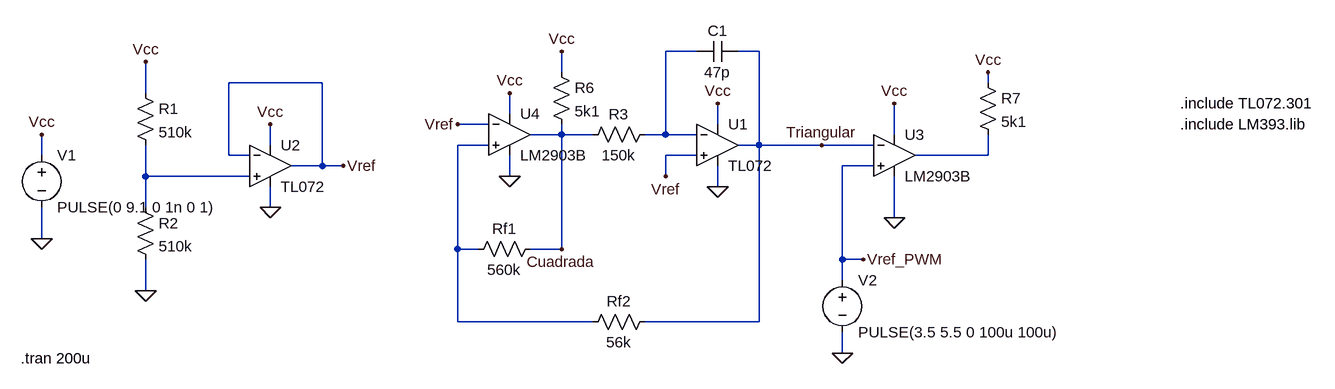
[diagram p0: schematic PWM.asc]
PWM.asc, the LTspice schematic file:
Version 4
SHEET 1 1432 680
WIRE 48 16 0 16
WIRE 144 16 112 16
WIRE -160 48 -160 16
WIRE -528 64 -672 64
WIRE 496 64 496 48
WIRE -800 80 -800 32
WIRE -240 112 -240 80
WIRE -272 128 -320 128
WIRE 80 128 80 96
WIRE -160 144 -160 128
WIRE -160 144 -208 144
WIRE -112 144 -160 144
WIRE 0 144 0 16
WIRE 0 144 -32 144
WIRE 48 144 0 144
WIRE 352 144 352 96
WIRE -608 160 -608 128
WIRE -272 160 -320 160
WIRE 144 160 144 16
WIRE 144 160 112 160
WIRE 240 160 144 160
WIRE 320 160 240 160
WIRE -960 176 -960 144
WIRE -672 176 -672 64
WIRE -640 176 -672 176
WIRE 48 176 0 176
WIRE 496 176 496 144
WIRE 496 176 384 176
WIRE -528 192 -528 64
WIRE -528 192 -576 192
WIRE -496 192 -528 192
WIRE 320 192 272 192
WIRE -800 208 -800 160
WIRE -640 208 -800 208
WIRE -240 208 -240 176
WIRE 0 208 0 176
WIRE 80 224 80 192
WIRE -800 256 -800 208
WIRE -608 256 -608 224
WIRE 352 272 352 208
WIRE -960 304 -960 256
WIRE -320 320 -320 160
WIRE -288 320 -320 320
WIRE -160 320 -160 144
WIRE -160 320 -208 320
WIRE 272 336 272 192
WIRE 304 336 272 336
WIRE 272 368 272 336
WIRE -800 384 -800 336
WIRE -320 432 -320 320
WIRE -112 432 -320 432
WIRE 144 432 144 160
WIRE 144 432 -32 432
WIRE 272 480 272 448
FLAG -960 304 0
FLAG -960 144 Vcc
FLAG -240 208 0
FLAG 80 224 0
FLAG -608 128 Vcc
FLAG -608 256 0
FLAG -800 384 0
FLAG -800 32 Vcc
FLAG -496 192 Vref
FLAG -240 80 Vcc
FLAG 80 96 Vcc
FLAG -320 128 Vref
FLAG 0 208 Vref
FLAG -160 320 Cuadrada
FLAG 240 160 Triangular
FLAG 272 480 0
FLAG 352 272 0
FLAG 352 96 Vcc
FLAG 304 336 Vref_PWM
FLAG -160 16 Vcc
FLAG 496 48 Vcc
SYMBOL voltage -960 160 R0
WINDOW 123 0 0 Left 0
WINDOW 39 0 0 Left 0
SYMATTR InstName V1
SYMATTR Value PULSE(0 9.1 0 1n 0 1)
SYMBOL res -816 64 R0
SYMATTR InstName R1
SYMATTR Value 510k
SYMBOL res -816 240 R0
SYMATTR InstName R2
SYMATTR Value 510k
SYMBOL res -192 304 R90
WINDOW 0 0 56 VBottom 2
WINDOW 3 32 56 VTop 2
SYMATTR InstName Rf1
SYMATTR Value 560k
SYMBOL cap 112 0 R90
WINDOW 0 0 32 VBottom 2
WINDOW 3 32 32 VTop 2
SYMATTR InstName C1
SYMATTR Value 47p
SYMBOL res -16 416 R90
WINDOW 0 0 56 VBottom 2
WINDOW 3 32 56 VTop 2
SYMATTR InstName Rf2
SYMATTR Value 56k
SYMBOL voltage 272 352 R0
WINDOW 123 0 0 Left 0
WINDOW 39 0 0 Left 0
SYMATTR InstName V2
SYMATTR Value PULSE(3.5 5.5 0 100u 100u)
SYMBOL res -176 32 R0
SYMATTR InstName R6
SYMATTR Value 5k1
SYMBOL Comparators\\LT1018 -240 144 R0
SYMATTR InstName U4
SYMATTR Value LM2903B
SYMBOL Comparators\\LT1018 352 176 R0
SYMATTR InstName U3
SYMATTR Value LM2903B
SYMBOL res 480 48 R0
SYMATTR InstName R7
SYMATTR Value 5k1
SYMBOL OpAmps\\opamp2 80 96 R0
SYMATTR InstName U1
SYMATTR Value TL072
SYMBOL OpAmps\\opamp2 -608 128 R0
SYMATTR InstName U2
SYMATTR Value TL072
SYMBOL res -16 128 R90
WINDOW 0 0 56 VBottom 2
WINDOW 3 32 56 VTop 2
SYMATTR InstName R3
SYMATTR Value 150k
TEXT -992 488 Left 2 !.tran 200u
TEXT 792 128 Left 2 !.include LM393.lib
TEXT 792 96 Left 2 !.include TL072.301

The netlist it stands for:
* PWM.asc
V1 Vcc 0 PULSE(0 9.1 0 1n 0 1)
R1 Vcc N004 510k
R2 N004 0 510k
Rf1 Cuadrada N002 560k
C1 Triangular N001 47p
Rf2 Triangular N002 56k
V2 Vref_PWM 0 PULSE(3.5 5.5 0 100u 100u)
R6 Vcc Cuadrada 5k1
XU4 N002 Vref Vcc 0 Cuadrada LT1018  ; LM2903B, pins In+ In- V+ V- OUT
XU3 Vref_PWM Triangular Vcc 0 N003 LT1018  ; LM2903B, pins In+ In- V+ V- OUT
R7 Vcc N003 5k1
XU1 Vref N001 Vcc 0 Triangular TL072  ; pins In+ In- V+ V- OUT
XU2 N004 Vref Vcc 0 Vref TL072  ; pins In+ In- V+ V- OUT
R3 N001 Cuadrada 150k
.tran 200u
.include LM393.lib
.include TL072.301
.lib LTC1.lib
.backanno
.end